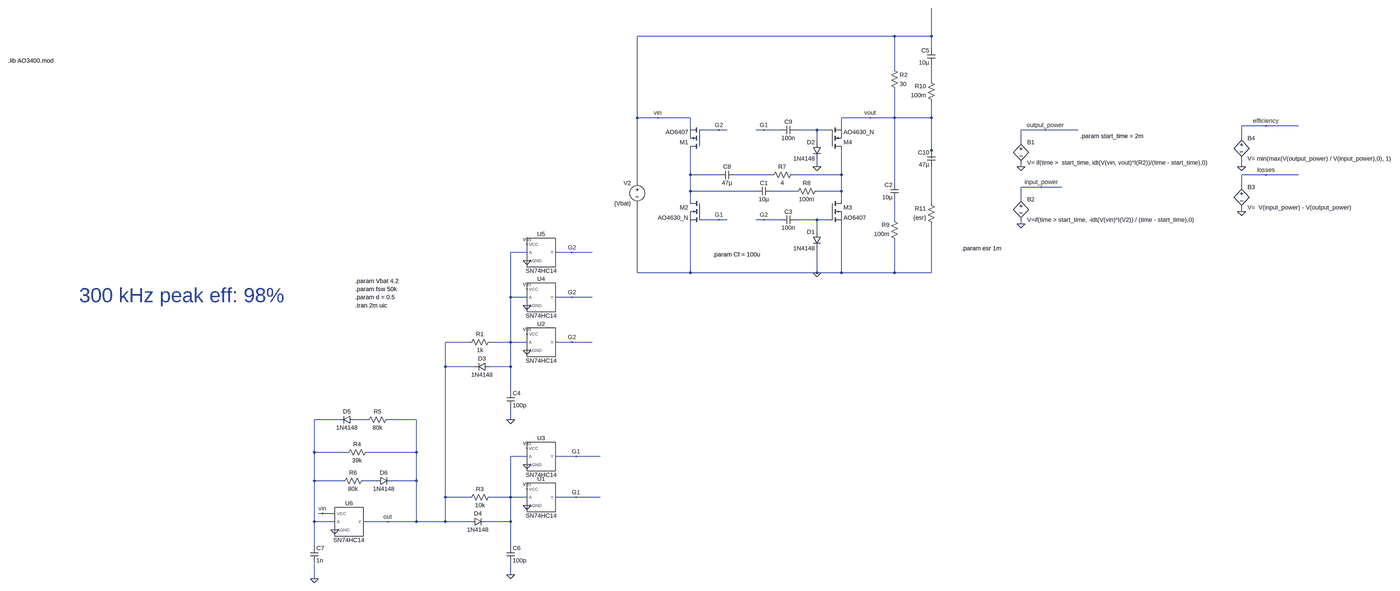
[diagram p0: schematic charge_pump_notch_recreation.asc, whole sheet]
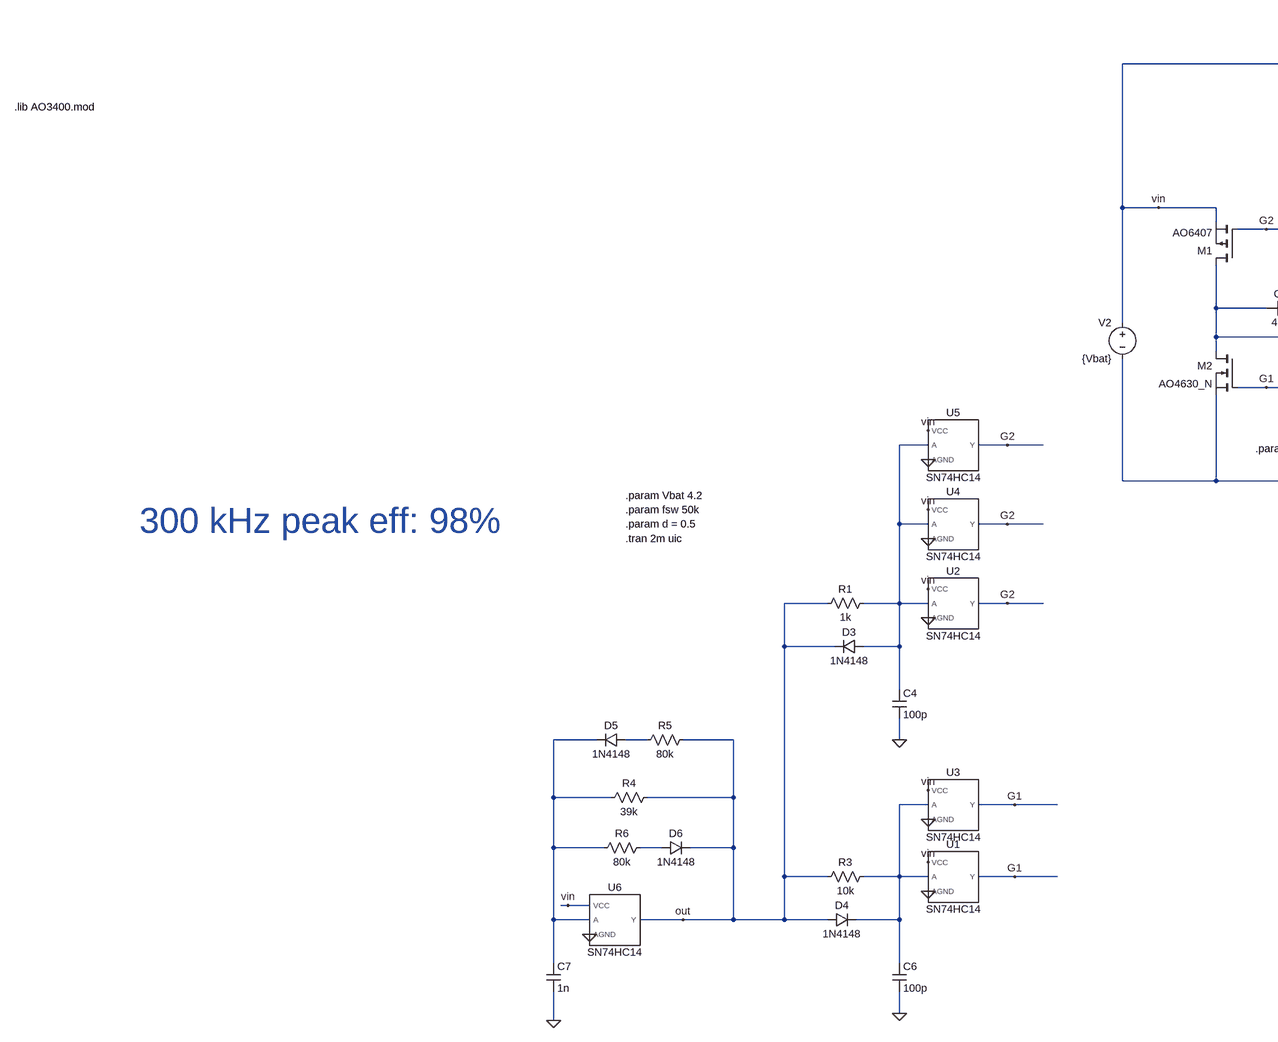
[diagram p1: schematic charge_pump_notch_recreation.asc, part, row 1 of 1, column 1 of 2]
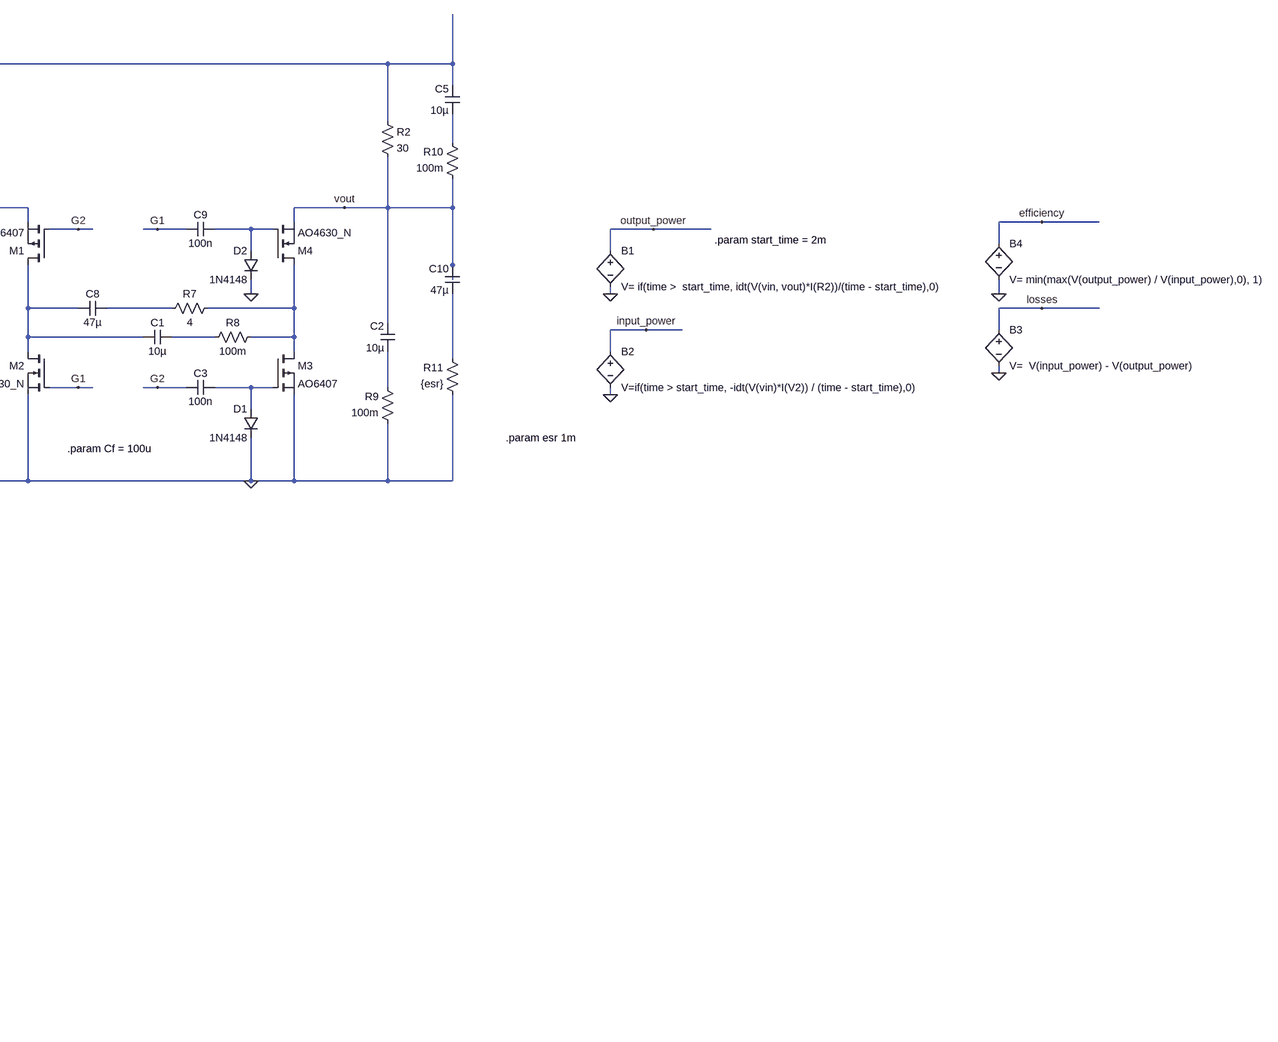
[diagram p2: schematic charge_pump_notch_recreation.asc, part, row 1 of 1, column 2 of 2]
charge_pump_notch_recreation.asc, the LTspice schematic file:
Version 4
SHEET 1 11460 3748
WIRE 2608 16 1600 16
WIRE 2752 16 2752 -112
WIRE 2752 16 2608 16
WIRE 2752 64 2752 16
WIRE 2608 144 2608 16
WIRE 2752 192 2752 128
WIRE 1600 336 1600 16
WIRE 1680 336 1600 336
WIRE 1808 336 1680 336
WIRE 2512 336 2400 336
WIRE 2608 336 2608 224
WIRE 2608 336 2512 336
WIRE 2752 336 2752 272
WIRE 2752 336 2608 336
WIRE 1808 368 1808 336
WIRE 2400 368 2400 336
WIRE 4128 368 4032 368
WIRE 4256 368 4128 368
WIRE 1920 384 1856 384
WIRE 1952 384 1920 384
WIRE 2096 384 2064 384
WIRE 2160 384 2096 384
WIRE 2304 384 2224 384
WIRE 2352 384 2304 384
WIRE 3264 384 3168 384
WIRE 3392 384 3264 384
WIRE 4032 416 4032 368
WIRE 2304 432 2304 384
WIRE 3168 432 3168 384
WIRE 2752 464 2752 336
WIRE 2752 496 2752 464
WIRE 2304 528 2304 496
WIRE 3168 528 3168 512
WIRE 4032 528 4032 496
WIRE 1808 560 1808 464
WIRE 1920 560 1808 560
WIRE 2128 560 1984 560
WIRE 2400 560 2400 464
WIRE 2400 560 2208 560
WIRE 4128 560 4032 560
WIRE 4256 560 4128 560
WIRE 1600 592 1600 336
WIRE 2608 592 2608 336
WIRE 3248 608 3168 608
WIRE 3328 608 3248 608
WIRE 4032 608 4032 560
WIRE 1808 624 1808 560
WIRE 2064 624 1808 624
WIRE 2224 624 2128 624
WIRE 2400 624 2400 560
WIRE 2400 624 2304 624
WIRE 1808 656 1808 624
WIRE 2400 656 2400 624
WIRE 3168 656 3168 608
WIRE 2752 672 2752 528
WIRE 4032 704 4032 688
WIRE 1920 736 1856 736
WIRE 1952 736 1920 736
WIRE 2096 736 2064 736
WIRE 2160 736 2096 736
WIRE 2304 736 2224 736
WIRE 2352 736 2304 736
WIRE 2608 736 2608 656
WIRE 3168 752 3168 736
WIRE 2304 784 2304 736
WIRE 1168 864 1104 864
WIRE 1344 864 1280 864
WIRE 1424 864 1344 864
WIRE 1600 944 1600 672
WIRE 1808 944 1808 752
WIRE 1808 944 1600 944
WIRE 2304 944 2304 848
WIRE 2304 944 1808 944
WIRE 2400 944 2400 752
WIRE 2400 944 2304 944
WIRE 2608 944 2608 816
WIRE 2608 944 2400 944
WIRE 2752 944 2752 752
WIRE 2752 944 2608 944
WIRE 1104 1040 1104 864
WIRE 1168 1040 1104 1040
WIRE 1344 1040 1280 1040
WIRE 1424 1040 1344 1040
WIRE 944 1216 848 1216
WIRE 1104 1216 1104 1040
WIRE 1104 1216 1024 1216
WIRE 1168 1216 1104 1216
WIRE 1344 1216 1280 1216
WIRE 1424 1216 1344 1216
WIRE 848 1312 848 1216
WIRE 960 1312 848 1312
WIRE 1104 1312 1104 1216
WIRE 1104 1312 1024 1312
WIRE 1104 1408 1104 1312
WIRE 416 1520 320 1520
WIRE 528 1520 480 1520
WIRE 720 1520 608 1520
WIRE 1104 1520 1104 1472
WIRE 320 1648 320 1520
WIRE 448 1648 320 1648
WIRE 720 1648 720 1520
WIRE 720 1648 528 1648
WIRE 1168 1664 1104 1664
WIRE 1360 1664 1280 1664
WIRE 1456 1664 1360 1664
WIRE 320 1760 320 1648
WIRE 432 1760 320 1760
WIRE 560 1760 512 1760
WIRE 720 1760 720 1648
WIRE 720 1760 624 1760
WIRE 848 1824 848 1312
WIRE 944 1824 848 1824
WIRE 1104 1824 1104 1664
WIRE 1104 1824 1024 1824
WIRE 1168 1824 1104 1824
WIRE 1360 1824 1280 1824
WIRE 1456 1824 1360 1824
WIRE 352 1888 336 1888
WIRE 400 1888 352 1888
WIRE 320 1920 320 1760
WIRE 400 1920 320 1920
WIRE 608 1920 512 1920
WIRE 720 1920 720 1760
WIRE 720 1920 608 1920
WIRE 848 1920 848 1824
WIRE 848 1920 720 1920
WIRE 944 1920 848 1920
WIRE 1104 1920 1104 1824
WIRE 1104 1920 1008 1920
WIRE 320 2016 320 1920
WIRE 1104 2016 1104 1920
WIRE 1104 2128 1104 2080
WIRE 320 2144 320 2080
FLAG 2304 944 0
FLAG 1920 736 G1
FLAG 1920 384 G2
FLAG 2304 528 0
FLAG 2096 736 G2
FLAG 2096 384 G1
FLAG 3168 528 0
FLAG 3168 752 0
FLAG 3264 384 output_power
FLAG 3248 608 input_power
FLAG 4032 528 0
FLAG 4128 368 efficiency
FLAG 4032 704 0
FLAG 4128 560 losses
FLAG 1680 336 vin
FLAG 2512 336 vout
FLAG 1104 1520 0
FLAG 1104 2128 0
FLAG 1168 1856 0
FLAG 1168 1248 0
FLAG 1168 1184 vin
FLAG 1168 1792 vin
FLAG 1360 1824 G1
FLAG 1344 1216 G2
FLAG 1168 1696 0
FLAG 1168 1632 vin
FLAG 1360 1664 G1
FLAG 1168 1072 0
FLAG 1168 1008 vin
FLAG 1344 1040 G2
FLAG 1168 896 0
FLAG 1168 832 vin
FLAG 1344 864 G2
FLAG 320 2144 0
FLAG 400 1952 0
FLAG 608 1920 out
FLAG 352 1888 vin
SYMBOL cap 2128 608 R90
WINDOW 0 0 32 VBottom 2
WINDOW 3 32 32 VTop 2
SYMATTR InstName C1
SYMATTR Value 10µ
SYMBOL cap 2624 656 R180
WINDOW 0 24 56 Left 2
WINDOW 3 24 8 Left 2
SYMATTR InstName C2
SYMATTR Value 10µ
SYMBOL cap 2160 720 M90
WINDOW 0 0 32 VBottom 2
WINDOW 3 32 32 VTop 2
SYMATTR InstName C3
SYMATTR Value 100n
SYMBOL diode 2320 784 M0
SYMATTR InstName D1
SYMATTR Value 1N4148
SYMBOL voltage 1600 576 M0
WINDOW 123 0 0 Left 0
WINDOW 39 0 0 Left 0
SYMATTR InstName V2
SYMATTR Value {Vbat}
SYMBOL res 2592 128 R0
SYMATTR InstName R2
SYMATTR Value 30
SYMBOL cap 2160 368 M90
WINDOW 0 0 32 VBottom 2
WINDOW 3 32 32 VTop 2
SYMATTR InstName C9
SYMATTR Value 100n
SYMBOL diode 2320 432 M0
SYMATTR InstName D2
SYMATTR Value 1N4148
SYMBOL pmos 1856 464 R180
SYMATTR InstName M1
SYMATTR Value AO6407
SYMBOL nmos 1856 656 M0
SYMATTR InstName M2
SYMATTR Value AO4630_N
SYMBOL pmos 2352 656 R0
SYMATTR InstName M3
SYMATTR Value AO6407
SYMBOL nmos 2352 464 M180
SYMATTR InstName M4
SYMATTR Value AO4630_N
SYMBOL bv 3168 416 R0
SYMATTR InstName B1
SYMATTR Value V= if(time >  start_time, idt(V(vin, vout)*I(R2))/(time - start_time),0)
SYMBOL bv 3168 640 R0
SYMATTR InstName B2
SYMATTR Value V=if(time > start_time, -idt(V(vin)*I(V2)) / (time - start_time),0)
SYMBOL bv 4032 592 R0
SYMATTR InstName B3
SYMATTR Value V=  V(input_power) - V(output_power)
SYMBOL bv 4032 400 R0
SYMATTR InstName B4
SYMATTR Value V= min(max(V(output_power) / V(input_power),0), 1)
SYMBOL res 1040 1200 R90
WINDOW 0 0 56 VBottom 2
WINDOW 3 32 56 VTop 2
SYMATTR InstName R1
SYMATTR Value 1k
SYMBOL cap 1088 1408 R0
SYMATTR InstName C4
SYMATTR Value 100p
SYMBOL diode 1024 1296 R90
WINDOW 0 0 32 VBottom 2
WINDOW 3 32 32 VTop 2
SYMATTR InstName D3
SYMATTR Value 1N4148
SYMBOL res 1040 1808 R90
WINDOW 0 0 56 VBottom 2
WINDOW 3 32 56 VTop 2
SYMATTR InstName R3
SYMATTR Value 10k
SYMBOL diode 944 1936 R270
WINDOW 0 32 32 VTop 2
WINDOW 3 0 32 VBottom 2
SYMATTR InstName D4
SYMATTR Value 1N4148
SYMBOL cap 1088 2016 R0
SYMATTR InstName C6
SYMATTR Value 100p
SYMBOL SN74HC14 1216 1808 R0
SYMATTR InstName U1
SYMBOL SN74HC14 1216 1200 R0
SYMATTR InstName U2
SYMBOL SN74HC14 1216 1648 R0
SYMATTR InstName U3
SYMBOL SN74HC14 1216 1024 R0
SYMATTR InstName U4
SYMBOL SN74HC14 1216 848 R0
SYMATTR InstName U5
SYMBOL cap 2768 128 R180
WINDOW 0 24 56 Left 2
WINDOW 3 24 8 Left 2
SYMATTR InstName C5
SYMATTR Value 10µ
SYMBOL SN74HC14 448 1904 R0
SYMATTR InstName U6
SYMBOL res 544 1632 R90
WINDOW 0 0 56 VBottom 2
WINDOW 3 32 56 VTop 2
SYMATTR InstName R4
SYMATTR Value 39k
SYMBOL cap 304 2016 R0
SYMATTR InstName C7
SYMATTR Value 1n
SYMBOL diode 480 1504 R90
WINDOW 0 0 32 VBottom 2
WINDOW 3 32 32 VTop 2
SYMATTR InstName D5
SYMATTR Value 1N4148
SYMBOL res 624 1504 R90
WINDOW 0 0 56 VBottom 2
WINDOW 3 32 56 VTop 2
SYMATTR InstName R5
SYMATTR Value 80k
SYMBOL diode 560 1776 R270
WINDOW 0 32 32 VTop 2
WINDOW 3 0 32 VBottom 2
SYMATTR InstName D6
SYMATTR Value 1N4148
SYMBOL res 416 1776 R270
WINDOW 0 32 56 VTop 2
WINDOW 3 0 56 VBottom 2
SYMATTR InstName R6
SYMATTR Value 80k
SYMBOL cap 1984 544 R90
WINDOW 0 0 32 VBottom 2
WINDOW 3 32 32 VTop 2
SYMATTR InstName C8
SYMATTR Value 47µ
SYMBOL res 2224 544 R90
WINDOW 0 0 56 VBottom 2
WINDOW 3 32 56 VTop 2
SYMATTR InstName R7
SYMATTR Value 4
SYMBOL res 2320 608 R90
WINDOW 0 0 56 VBottom 2
WINDOW 3 32 56 VTop 2
SYMATTR InstName R8
SYMATTR Value 100m
SYMBOL res 2624 832 R180
WINDOW 0 36 76 Left 2
WINDOW 3 36 40 Left 2
SYMATTR InstName R9
SYMATTR Value 100m
SYMBOL res 2768 288 R180
WINDOW 0 36 76 Left 2
WINDOW 3 36 40 Left 2
SYMATTR InstName R10
SYMATTR Value 100m
SYMBOL cap 2768 528 R180
WINDOW 0 24 56 Left 2
WINDOW 3 24 8 Left 2
SYMATTR InstName C10
SYMATTR Value 47µ
SYMBOL res 2768 768 R180
WINDOW 0 36 76 Left 2
WINDOW 3 36 40 Left 2
SYMATTR InstName R11
SYMATTR Value {esr}
TEXT 480 1008 Left 2 !.param fsw 50k
TEXT 480 1040 Left 2 !.param d = 0.5
TEXT 1896 872 Left 2 !.param Cf = 100u
TEXT 480 1072 Left 2 !.tran 2m uic
TEXT -1536 112 Left 2 !.lib AO3400.mod
TEXT 480 976 Left 2 !.param Vbat 4.2
TEXT 3400 408 Left 2 !.param start_time = 2m
TEXT -1008 1032 Left 6 ;300 kHz peak eff: 98%
TEXT 2936 848 Left 2 !.param esr 1m

The netlist it stands for:
* charge_pump_notch_recreation.asc
C1 N006 N003 10µ
C2 N009 vout 10µ
C3 G2 N008 100n
D1 N008 0 1N4148
V2 vin 0 {Vbat}
R2 vin vout 30
C9 G1 N002 100n
D2 N002 0 1N4148
M1 N003 G2 vin vin AO6407
M2 N003 G1 0 0 AO4630_N
M3 N005 N008 0 0 AO6407
M4 N005 N002 vout vout AO4630_N
B1 output_power 0 V= if(time >  start_time, idt(V(vin, vout)*I(R2))/(time - start_time),0)
B2 input_power 0 V=if(time > start_time, -idt(V(vin)*I(V2)) / (time - start_time),0)
B3 losses 0 V=  V(input_power) - V(output_power)
B4 efficiency 0 V= min(max(V(output_power) / V(input_power),0), 1)
R1 N010 out 1k
C4 N010 0 100p
D3 N010 out 1N4148
R3 N013 out 10k
D4 out N013 1N4148
C6 N013 0 100p
XU1 G1 N013 vin 0 SN74HC14  ; pins Y A VCC AGND
XU2 G2 N010 vin 0 SN74HC14  ; pins Y A VCC AGND
XU3 G1 N013 vin 0 SN74HC14  ; pins Y A VCC AGND
XU4 G2 N010 vin 0 SN74HC14  ; pins Y A VCC AGND
XU5 G2 N010 vin 0 SN74HC14  ; pins Y A VCC AGND
C5 N001 vin 10µ
XU6 out N011 vin 0 SN74HC14  ; pins Y A VCC AGND
R4 out N011 39k
C7 N011 0 1n
D5 N012 N011 1N4148
R5 out N012 80k
D6 N014 out 1N4148
R6 N011 N014 80k
C8 N004 N003 47µ
R7 N005 N004 4
R8 N005 N006 100m
R9 0 N009 100m
R10 vout N001 100m
C10 N007 vout 47µ
R11 0 N007 {esr}
.model D D
.lib standard.dio
.model NMOS NMOS
.model PMOS PMOS
.lib standard.mos
.param fsw 50k
.param d = 0.5
.param Cf = 100u
.tran 2m uic
.lib AO3400.mod
.param Vbat 4.2
.param start_time = 2m
* 300 kHz peak eff: 98%
.param esr 1m
.lib SN74HC14.cir
.backanno
.end